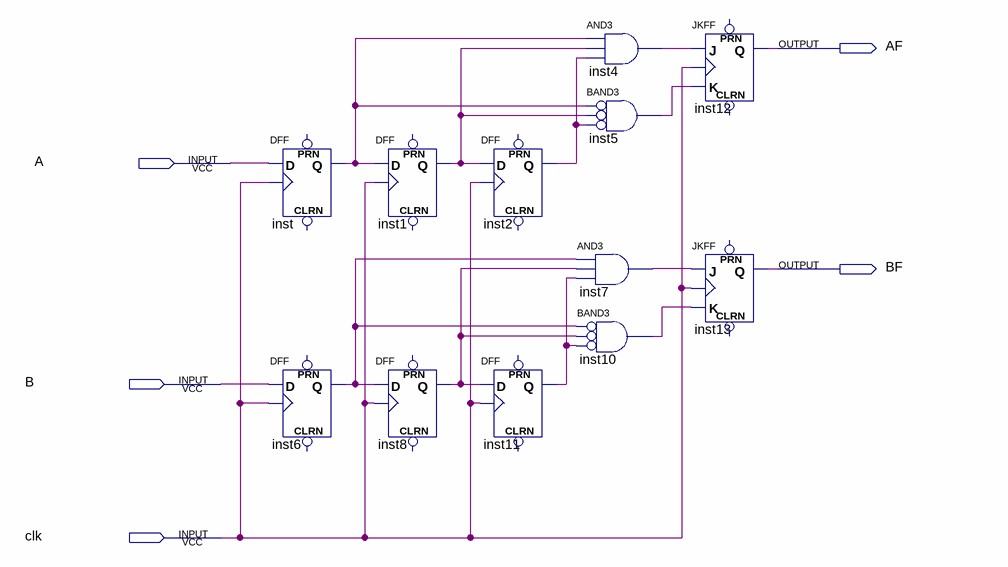
[diagram p0: schematic sheet]
// Quartus schematic enc_filter.bdf as structural Verilog: 12 symbols, 5 pins
module enc_filter (
  input  A,
  input  B,
  input  clk,
  output AF,
  output BF
);

  wire inst1_q, inst2_q, inst4_out, inst5_out, inst6_q, inst7_out, inst8_q, inst10_out, inst11_q, inst_q;

  DFF inst (.CLK(clk), .D(A), .Q(inst_q));  // open: CLRN, PRN
  DFF inst6 (.CLK(clk), .D(B), .Q(inst6_q));  // open: CLRN, PRN
  DFF inst1 (.CLK(clk), .D(inst_q), .Q(inst1_q));  // open: CLRN, PRN
  DFF inst8 (.CLK(clk), .D(inst6_q), .Q(inst8_q));  // open: CLRN, PRN
  DFF inst2 (.CLK(clk), .D(inst1_q), .Q(inst2_q));  // open: CLRN, PRN
  DFF inst11 (.CLK(clk), .D(inst8_q), .Q(inst11_q));  // open: CLRN, PRN
  and inst7 (inst7_out, inst6_q, inst8_q, inst11_q);
  and inst10 (inst10_out, ~inst6_q, ~inst8_q, ~inst11_q);  // BAND3
  and inst4 (inst4_out, inst_q, inst1_q, inst2_q);
  and inst5 (inst5_out, ~inst_q, ~inst1_q, ~inst2_q);  // BAND3
  JKFF inst12 (.K(inst5_out), .J(inst4_out), .CLK(clk), .Q(AF));  // open: PRN, CLRN
  JKFF inst13 (.K(inst10_out), .J(inst7_out), .CLK(clk), .Q(BF));  // open: PRN, CLRN
endmodule
